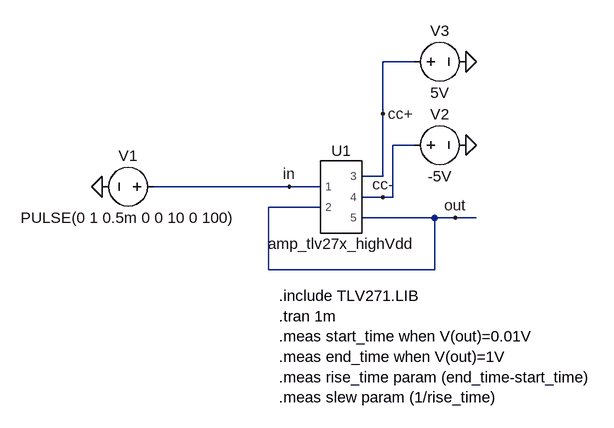
[diagram p0: schematic Exercise5_a.asc]
Exercise5_a.asc, the LTspice schematic file:
Version 4.1
SHEET 1 880 680
WIRE -176 -96 -224 -96
WIRE -224 -16 -224 -96
WIRE -176 32 -208 32
WIRE -224 80 -224 -16
WIRE -224 80 -256 80
WIRE -368 96 -576 96
WIRE -320 96 -368 96
WIRE -224 112 -256 112
WIRE -208 112 -208 32
WIRE -208 112 -224 112
WIRE -320 128 -400 128
WIRE -144 144 -256 144
WIRE -112 144 -144 144
WIRE -80 144 -112 144
WIRE -400 224 -400 128
WIRE -144 224 -144 144
WIRE -144 224 -400 224
FLAG -656 96 0
FLAG -96 -96 0
FLAG -96 32 0
FLAG -368 96 in
FLAG -224 -16 cc+
FLAG -224 112 cc-
FLAG -112 144 out
SYMBOL amp_tlv27x_highVdd1 -288 112 R0
SYMATTR InstName U1
SYMBOL voltage -560 96 R90
WINDOW 0 -32 56 VBottom 2
WINDOW 3 32 56 VTop 2
WINDOW 123 0 0 Left 0
WINDOW 39 0 0 Left 0
SYMATTR InstName V1
SYMATTR Value PULSE(0 1 0.5m 0 0 10 0 100)
SYMBOL voltage -192 32 R270
WINDOW 0 32 56 VTop 2
WINDOW 3 -32 56 VBottom 2
WINDOW 123 0 0 Left 0
WINDOW 39 0 0 Left 0
SYMATTR InstName V2
SYMATTR Value -5V
SYMBOL voltage -192 -96 R270
WINDOW 0 32 56 VTop 2
WINDOW 3 -32 56 VBottom 2
WINDOW 123 0 0 Left 0
WINDOW 39 0 0 Left 0
SYMATTR InstName V3
SYMATTR Value 5V
TEXT -384 264 Left 2 !.include TLV271.LIB\n.tran 1m\n.meas start_time when V(out)=0.01V\n.meas end_time when V(out)=1V\n.meas rise_time param (end_time-start_time)\n.meas slew param (1/rise_time)

The netlist it stands for:
* Exercise5_a.asc
X§U1 in out cc+ cc- out amp_tlv27x_highVdd  ; pins 1 2 3 4 5
V1 in 0 PULSE(0 1 0.5m 0 0 10 0 100)
V2 cc- 0 -5V
V3 cc+ 0 5V
.include TLV271.LIB
.tran 1m
.meas start_time when V(out)=0.01V
.meas end_time when V(out)=1V
.meas rise_time param (end_time-start_time)
.meas slew param (1/rise_time)
.lib TLV271.LIB
.backanno
.end

* Results of the author's LTspice run, read from the files saved beside the schematic
* Operating Point, zero values left out:
*   V(cc+) = 5 V
*   V(cc-) = -5 V
*   V(out) = -280.4 µV
*   I(V1) = 6.9 pA
*   I(V2) = 67.78 µA
*   I(V3) = -67.78 µA
*   Ix(u1:1) = -6.9 pA
*   Ix(u1:2) = -6.901 pA
*   Ix(u1:3) = 67.78 µA
*   Ix(u1:4) = -67.78 µA
*   Ix(u1:5) = 7.131 pA
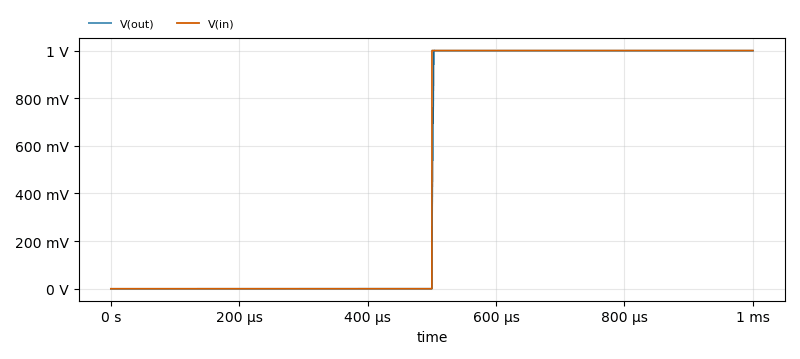
[diagram p1: Transient Analysis of Exercise5_a.asc, plotted from the saved traces]
* Transient Analysis, 1 run:
*   V(out): min -280.4 µV, max 1.001 V, average 498.4 mV, rms 705.5 mV, last 999.4 mV
*   V(in): min 0 V, max 1 V, average 500 mV, rms 707.1 mV, last 1 V
* From the log:
*   start_time: V(out)=0.01V AT 0.000500007940217
*   end_time: V(out)=1V AT 0.000503502719411
*   rise_time: (end_time-start_time)=3.49477919435e-06
*   slew: (1/rise_time)=286141.110607